# Altium project PR003.PrjPcb (part 10 of 11)
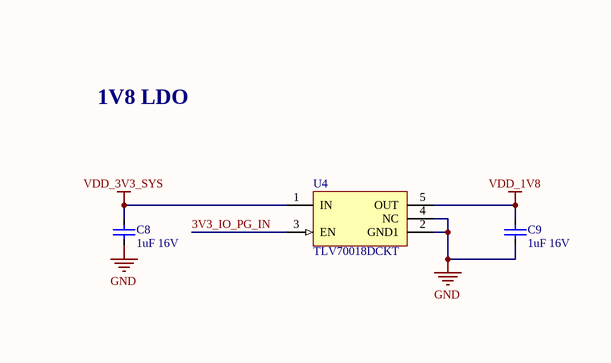
[diagram p117: Power_Circuit.SchDoc, right]

## Sheet Power_Circuit.SchDoc (continued)

### Library data of the parts (continued)
R23 = AC0603FR-0710KL: RES SMD 10K OHM 1% 1/10W 0603; Manufacturer: Yageo; Resistance: 10kR; Power Rating: 100mW; Voltage Rating: 50V; Temperature Coefficient: 100ppm/°C; Supplier 1: Digi-Key; Manufacturer Part Number: AC0603FR-0710KL; RoHS: Yes; Category: Chip SMD Resistors; Stock 1: 1821004; Pricing 1: 1=0.10000, 10=0.02500, 100=0.01030, 1000=0.00463, 2500=0.00402 (USD); Mount: Surface Mount; Case/Package: 0603; Case Code (Imperial): 0603; Case Code (Metric): 1608; Size Code: 0603; Min Operating Temperature: -55°C; Max Operating Temperature: 155°C; Tolerance: 1%; Packaging: Tape and Reel; Package Quantity: 1; Termination: SMD/SMT; Resistor Type: Thick Film; Number of Terminations: 2; Max Power Dissipation: 100mW; Features: Moisture Resistant,Automotive AEC-Q200,Anti-Sulfur; Series: AC; Construction: Rectangular; Length: 1.6mm; Width: 0.8mm; Height: 0.022inch; Depth: 0.8mm; Military Standard: Not; Lead Free: Lead Free; RoHS Compliant: Yes; ComponentLink1URL: https://datasheet.ciiva.com/26862/getdatasheetpartid-724997-26862461.pdf?src-supplier=Verical; ComponentLink1Description: https://datasheet.ciiva.com/26862/getdatasheetpartid-724997-26862461.pdf?src-supplier=Verical; Supplier Part Number 1: 311-10KLDCT-ND
R27 = RC0402FR-0740K2L: Res Thick Film 0402 40.2K Ohm 1% 0.063W(1/16W) ±100ppm/°C Pad SMD T/R; Manufacturer: Yageo; Resistance: 40.2kR; Power Rating: 62.5mW; Voltage Rating: 50V; Max Power Dissipation: 63mW; Supplier 1: Digi-Key; Manufacturer Part Number: RC0402FR-0740K2L; RoHS: Yes; Category: Chip SMD Resistors; Stock 1: 2852749; Pricing 1: 1=0.10000, 10=0.01400, 100=0.00580, 1000=0.00262, 2500=0.00228, 5000=0.00188 (USD); Case/Package: 0402; Case Code (Metric): 1005; Case Code (Imperial): 0402; Contact Plating: Tin,Matte; Size Code: 0402; Min Operating Temperature: -55°C; Max Operating Temperature: 155°C; Package Quantity: 1; Tolerance: 1%; Packaging: Tape and Reel; Resistor Type: Thick Film; Number of Terminations: 2; Termination: SMD/SMT; Temperature Coefficient: 100ppm/°C; Features: Moisture Resistant; Series: RC; Construction: Rectangular; Voltage Rating (DC): 50V; Length: 0.039inch; Width: 0.02inch; Height: 0.016inch; Depth: 0.5mm; Military Standard: Not; Lead Free: Lead Free; RoHS Compliant: Yes; ComponentLink1URL: https://datasheet.ciiva.com/2453/pyu-r-int-thick-7-2453437.pdf?src-supplier=Digi-Key; ComponentLink1Description: https://datasheet.ciiva.com/2453/pyu-r-int-thick-7-2453437.pdf?src-supplier=Digi-Key; ComponentLink2URL: https://datasheet.ciiva.com/2453/pyu-r-int-thick-7-2453438.pdf?src-supplier=Digi-Key; ComponentLink2Description: https://datasheet.ciiva.com/2453/pyu-r-int-thick-7-2453438.pdf?src-supplier=Digi-Key; ComponentLink3URL: https://datasheet.ciiva.com/2453/pyu-r-int-thick-7-2453436.pdf?src-supplier=Digi-Key; ComponentLink3Description: https://datasheet.ciiva.com/2453/pyu-r-int-thick-7-2453436.pdf?src-supplier=Digi-Key; ComponentLink4URL: https://datasheet.ciiva.com/5557/pyu-rc0402-51-rohs-l-6-r-5557981.pdf?src-supplier=Mouser; ComponentLink4Description: https://datasheet.ciiva.com/5557/pyu-rc0402-51-rohs-l-6-r-5557981.pdf?src-supplier=Mouser; ComponentLink5URL: https://datasheet.ciiva.com/8889/pyu-rc0402-51-rohs-l-6-8889263.pdf?src-supplier=Avnet; ComponentLink5Description: https://datasheet.ciiva.com/8889/pyu-rc0402-51-rohs-l-6-8889263.pdf?src-supplier=Avnet; ComponentLink6URL: https://datasheet.ciiva.com/16744/pyu-rc0402-51-rohs-l-6-r-16744286.pdf?src-supplier=Future+Electronics; ComponentLink6Description: https://datasheet.ciiva.com/16744/pyu-rc0402-51-rohs-l-6-r-16744286.pdf?src-supplier=Future+Electronics; Supplier Part Number 1: 311-40.2KLRCT-ND
R29 = RC0402FR-078K87L: Res Thick Film 0402 8.87K Ohm 1% 1/16W ±100ppm/°C Molded SMD Paper T/R; Manufacturer: Yageo; Resistance: 8.87kR; Voltage Rating (DC): 50V; Power Rating: 62.5mW; Max Power Dissipation: 63mW; Supplier 1: Digi-Key; Manufacturer Part Number: RC0402FR-078K87L; RoHS: Yes; Category: Chip SMD Resistors; Stock 1: 661203; Pricing 1: 1=0.10000, 10=0.01400, 100=0.00580, 1000=0.00262, 2500=0.00228, 5000=0.00188 (USD); Case/Package: 0402; Case Code (Imperial): 0402; Case Code (Metric): 1005; Contact Plating: Tin,Matte; Min Operating Temperature: -55°C; Max Operating Temperature: 155°C; Tolerance: 1%; Packaging: Tape and Reel; Features: Moisture Resistant; Voltage Rating: 50V; Termination: SMD/SMT; Resistor Type: Thick Film; Temperature Coefficient: 100ppm/°C; Number of Terminations: 2; Series: RC; Construction: Rectangular; Working Voltage: 50V; Technology: THICK FILM; Length: 1mm; Width: 0.5mm; Height: 0.35mm; Depth: 0.5mm; Lead Free: Lead Free; Military Standard: Not; RoHS Compliant: Yes; ComponentLink1URL: https://datasheet.ciiva.com/12575/pyu-rc0402-51-rohs-l-6-r-8721-12575212.pdf?src-supplier=Mouser; ComponentLink1Description: https://datasheet.ciiva.com/12575/pyu-rc0402-51-rohs-l-6-r-8721-12575212.pdf?src-supplier=Mouser; ComponentLink2URL: https://datasheet.ciiva.com/16743/pyu-rc0402-51-rohs-l-6-r-16743879.pdf?src-supplier=Future+Electronics; ComponentLink2Description: https://datasheet.ciiva.com/16743/pyu-rc0402-51-rohs-l-6-r-16743879.pdf?src-supplier=Future+Electronics; Supplier Part Number 1: 311-8.87KLRCT-ND
U1 U2 = TPS25944LRVCT: Hot Swap Controller 1-CH 18V N-Channel Positive Voltage 20-Pin WQFN EP T/R; Manufacturer: Texas Instruments; Min Supply Voltage: 2.7V; Number of Channels: 1; Supplier 1: Mouser; Manufacturer Part Number: TPS25944LRVCT; RoHS: Yes; Category: Power Management ICs; Stock 1: 1962; Pricing 1: 1=2.72000, 10=2.45000, 50=2.31000, 100=1.97000, 1000=1.34000, 10000=1.34000 (USD); Number of Pins: 20; Min Operating Temperature: -40°C; Max Operating Temperature: 85°C; Max Supply Voltage: 18V; Packaging: Cut Tape; Reach SVHC Compliant: Yes; Lead Free: Lead Free; RoHS Compliant: Yes; ComponentLink1URL: http://www.ti.com/general/docs/lit/getliterature.tsp?genericPartNumber=TPS25944L&&fileType=pdf&src-supplier=Farnell; ComponentLink1Description: http://www.ti.com/general/docs/lit/getliterature.tsp?genericPartNumber=TPS25944L&&fileType=pdf&src-supplier=Farnell; ComponentLink2URL: http://www.ti.com/general/docs/lit/getliterature.tsp?genericPartNumber=TPS25944L&&fileType=pdf&src-supplier=Element14; ComponentLink2Description: http://www.ti.com/general/docs/lit/getliterature.tsp?genericPartNumber=TPS25944L&&fileType=pdf&src-supplier=Element14; ComponentLink3URL: http://www.ti.com/general/docs/lit/getliterature.tsp?genericPartNumber=TPS25944L&amp;&amp;fileType=pdf&src-supplier=Farnell; ComponentLink3Description: http://www.ti.com/general/docs/lit/getliterature.tsp?genericPartNumber=TPS25944L&amp;&amp;fileType=pdf&src-supplier=Farnell; ComponentLink4URL: http://www.ti.com/lit/pdf/slvsce9?src-supplier=Digi-Key; ComponentLink4Description: http://www.ti.com/lit/pdf/slvsce9?src-supplier=Digi-Key; ComponentLink5URL: http://www.ti.com/general/docs/suppproductinfo.tsp?distId=10&amp;gotoUrl=http%3A%2F%2Fwww.ti.com%2Flit%2Fgpn%2FTPS25942A&src-supplier=Digi-Key; ComponentLink5Description: http://www.ti.com/general/docs/suppproductinfo.tsp?distId=10&amp;gotoUrl=http%3A%2F%2Fwww.ti.com%2Flit%2Fgpn%2FTPS25942A&src-supplier=Digi-Key; ComponentLink6URL: http://www.ti.com/general/docs/lit/getliterature.tsp?genericPartNumber=TPS25942L&&fileType=pdf&src-supplier=Avnet; ComponentLink6Description: http://www.ti.com/general/docs/lit/getliterature.tsp?genericPartNumber=TPS25942L&&fileType=pdf&src-supplier=Avnet; Supplier Part Number 1: 595-TPS25944LRVCT
U3 = SN74LVC1G07DCKRE4: Single 1.65-V to 5.5-V buffer with open-drain outputs 5-SC70 -40 to 125; Manufacturer: Texas Instruments; Logic Function: Buffer,Inverting; Number of Elements: 1; Max Supply Voltage: 5.5V; Min Supply Voltage: 1.65V; Propagation Delay: 4.2ns; Low Level Output Current: 32mA; Polarity: Non-Inverting; Turn-On Delay Time: 8.3ns; Quiescent Current: 10uA; Supplier 1: Digi-Key; Manufacturer Part Number: SN74LVC1G07DCKRE4; RoHS: Yes; Category: Buffers, Drivers and Transceivers; Stock 1: 1390; Pricing 1: 1=0.32000, 10=0.24000, 25=0.21000, 100=0.13590, 250=0.11248, 500=0.09000, 1000=0.06900 (USD); Mount: Surface Mount; Case/Package: SC; Number of Pins: 5; Min Operating Temperature: -40°C; Max Operating Temperature: 125°C; Packaging: Tape and Reel; Package Quantity: 1; Number of Channels: 1; Number of Inputs: 1; Number of Outputs: 1; Number of Bits per Element: 1; Number of Input Lines: 1; Number of Output Lines: 1; Number of Gates: 1; Number of Bits: 1; Series: 74LVC; Technology: CMOS; Radiation Hardening: No; Reach SVHC Compliant: Yes; Lead Free: Lead Free; RoHS Compliant: Yes; ComponentLink1URL: https://datasheet.ciiva.com/14319/sn74lvc1g07-14319317.pdf?src-supplier=Avnet; ComponentLink1Description: https://datasheet.ciiva.com/14319/sn74lvc1g07-14319317.pdf?src-supplier=Avnet; ComponentLink2URL: https://datasheet.ciiva.com/18621/sn74lvc1g07-18621567.pdf?src-supplier=Digi-Key; ComponentLink2Description: https://datasheet.ciiva.com/18621/sn74lvc1g07-18621567.pdf?src-supplier=Digi-Key; Supplier Part Number 1: 296-35936-1-ND
U4 = TLV70018DCKT: IC, LDO, 200MA, 1.8V, 5SC70; Input Voltage Min:2V; Input Voltage Max:5.5V; Output Voltage Nom.:1.8V; Output Current:200mA; Dropout Voltage Vdo:175mV; LDO Regulator Case Style:SC-70; No. of Pins:5; Operating Temperature Min:-40°C; ;RoHS Compliant: Yes; Manufacturer: Texas Instruments; Dropout Voltage: 175mV; Number of Outputs: 1; Max Power Dissipation: 320mW; Max Input Voltage: 5.5V; Min Input Voltage: 2V; Min Current Limit: 220mA; Polarity: Positive; Quiescent Current: 30uA; Accuracy: 2%; Max Supply Current: 270uA; Nominal Supply Current: 31uA; Output Type: Fixed; Power Supply Rejection Ratio (PSRR): 68dB; Supplier 1: Digi-Key; Manufacturer Part Number: TLV70018DCKT; RoHS: Yes; Category: Voltage Regulators - Linear; Stock 1: 6750; Pricing 1: 1=1.08000, 10=0.96600, 25=0.91720, 100=0.75330 (USD); Case/Package: SC; Number of Pins: 5; Contact Plating: Gold; Min Operating Temperature: -40°C; Max Operating Temperature: 125°C; Output Current: 200mA; Nominal Output Voltage: 1.8V; Packaging: Tape and Reel; Output Voltage: 1.8V; Package Quantity: 250; Max Output Current: 200mA; Number of Regulators: 1; Power Dissipation: 320mW; Min Output Voltage: 1.8V; Power Rating: 320mW; Output Voltage Accuracy: 2%; Max Output Voltage: 1.8V; Series: -; Supply Current: 31uA; Output Configuration: Positive; Length: 2.15mm; Width: 1.4mm; Height: 1mm; Radiation Hardening: No; Reach SVHC Compliant: Yes; Lead Free: Lead Free; RoHS Compliant: Yes; ComponentLink1URL: https://datasheet.ciiva.com/14149/tlv700-eng-ds-14149837.pdf?src-supplier=Distrelec; ComponentLink1Description: https://datasheet.ciiva.com/14149/tlv700-eng-ds-14149837.pdf?src-supplier=Distrelec; ComponentLink2URL: https://datasheet.ciiva.com/7992/1882059-7992894.pdf?src-supplier=Element14; ComponentLink2Description: https://datasheet.ciiva.com/7992/1882059-7992894.pdf?src-supplier=Element14; ComponentLink3URL: https://datasheet.ciiva.com/22700/1882059-22700171.pdf?src-supplier=Element14; ComponentLink3Description: https://datasheet.ciiva.com/22700/1882059-22700171.pdf?src-supplier=Element14; Supplier Part Number 1: 296-25269-1-ND
U5 = MP2384GG-Z: IC Reg Buck Adjustable 4A 11QFN; Manufacturer: Monolithic Power Systems; Output Configuration: Positive; Number of Outputs: 1; Min Input Voltage: 4.5V; Max Input Voltage: 24V; Min Output Voltage: 600mV; Max Output Voltage: 13V; Switching Frequency: 700kHz; Synchronous Rectifier: Yes; Supplier 1: Mouser; Manufacturer Part Number: MP2384GG-Z; RoHS: No; Category: Voltage Regulators - Switching; Stock 1: 14980; Pricing 1: 1=1.97000, 10=1.77000, 50=1.67000, 100=1.43000, 1000=0.96900, 10000=0.88100 (USD); Mount: Surface Mount; Case/Package: QFN; Number of Pins: 11; Min Operating Temperature: -40°C; Max Operating Temperature: 125°C; Output Type: Adjustable; Packaging: Tape and Reel; Output Current: 4A; ComponentLink1URL: https://media.digikey.com/pdf/Data%20Sheets/Monolithic%20Power%20PDFs/MP2384_r1.0.pdf?src-supplier=Digi-Key; ComponentLink1Description: https://media.digikey.com/pdf/Data%20Sheets/Monolithic%20Power%20PDFs/MP2384_r1.0.pdf?src-supplier=Digi-Key; Supplier Part Number 1: 946-MP2384GG-Z

## Sheet ON_OFF_Circuit.SchDoc
size A3; SheetNumber: 16; SheetTotal: 16
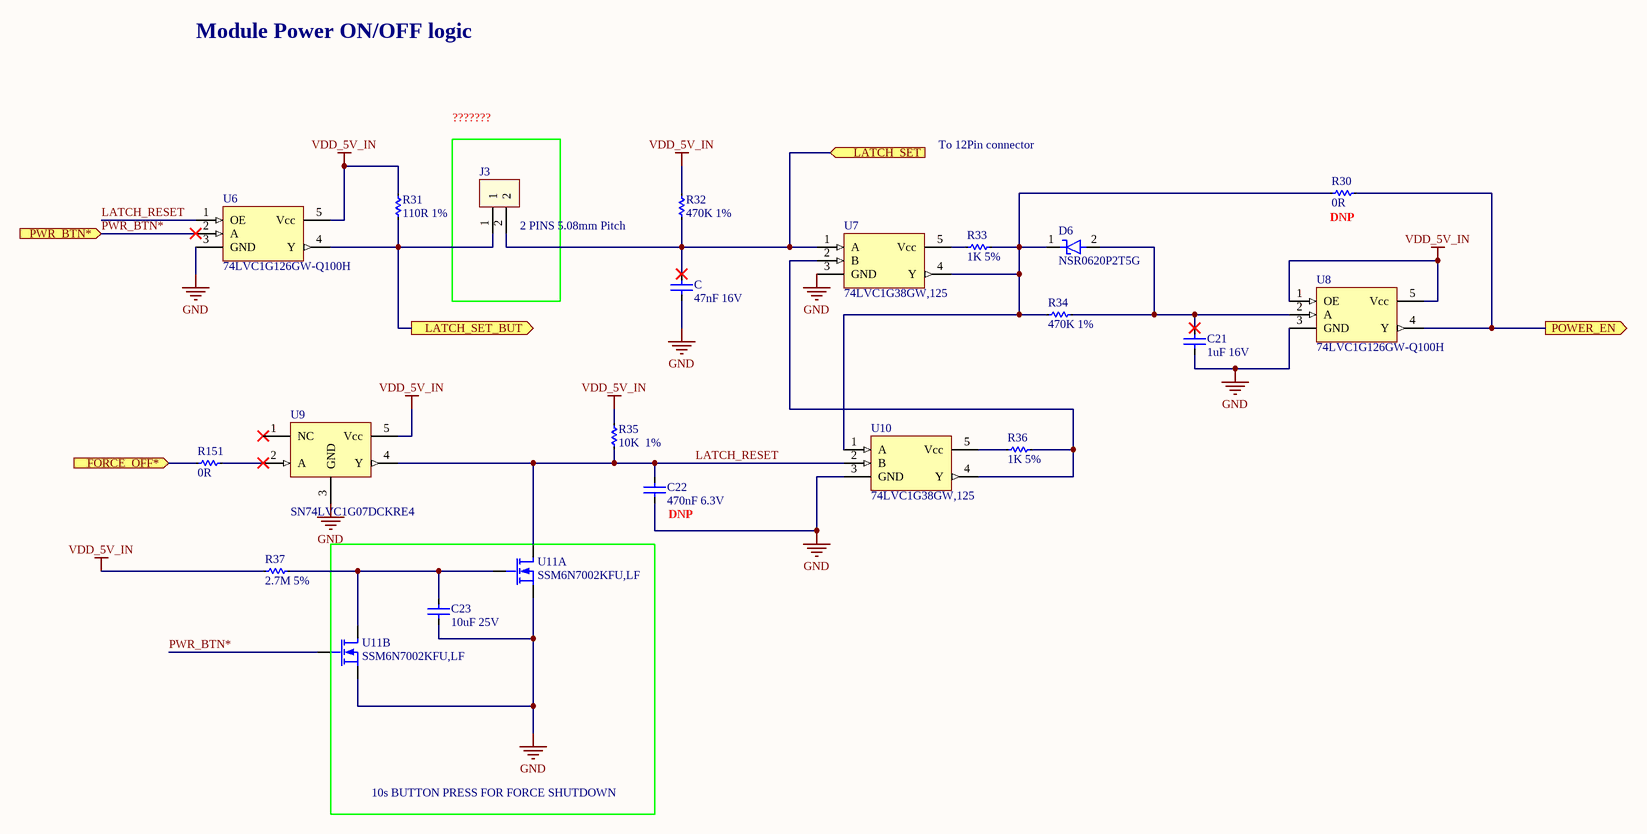
[diagram p15: ON_OFF_Circuit.SchDoc]

### Parts
C  47nF 16V  [C0603]
C21  1uF 16V  [C0603]
C22  470nF 6.3V  [C0402]
C23  10uF 25V  [C0805]
D6  NSR0620P2T5G  [SOD-923]
J3  2 PINS 5.08mm Pitch  [0395443002]
R30  0R  [R0603]
R31  110R 1%  [R0402]
R32  470K 1%  [R0402]
R33  1K 5%  [R0402]
R34  470K 1%  [R0402]
R35  10K  1%  [R0402]
R36  1K 5%  [R0402]
R37  2.7M 5%  [R0402]
R151  0R  [R0402]
U6  74LVC1G126GW-Q100H  [SOT-353-1(TSSOP5)]
U7  74LVC1G38GW,125  [SOT-353-1(TSSOP5)]
U8  74LVC1G126GW-Q100H  [SOT-353-1(TSSOP5)]
U9  SN74LVC1G07DCKRE4  [SC70-5]
U10  74LVC1G38GW,125  [SOT-353-1(TSSOP5)]
U11  SSM6N7002KFU,LF  [SOT-363]  (parts A,B of 2)

### Blocks framed on the sheet
???????: J3
10s BUTTON PRESS FOR FORCE SHUTDOWN: C23 U11

### Ports
FORCE_OFF* (in), LATCH_SET (in), LATCH_SET_BUT (out), POWER_EN (out), PWR_BTN* (in)

### Nets
GND: C.1 C21.1 C22.1 C23.1 U6.3(GND) U7.3(GND) U8.3(GND) U9.3(GND) U10.3(GND) U11.1(S1) U11.4(S2)
VDD_5V_IN: R31.2 R32.2 R35.1 R37.1 U6.5(Vcc) U8.1(OE) U8.5(Vcc) U9.5(Vcc)
FORCE_OFF*: R151.1 ; port FORCE_OFF*
LATCH_RESET: C22.2 R35.2 U6.1(OE) U9.4(Y) U10.2(B) U11.6(D1)
LATCH_SET: C.2 J3.2 R32.1 U7.1(A) ; port LATCH_SET
LATCH_SET_BUT: J3.1 R31.1 U6.4(Y) ; port LATCH_SET_BUT
POWER_EN: R30.2 U8.4(Y) ; port POWER_EN
PWR_BTN*: U6.2(A) U11.5(G2) ; port PWR_BTN*
NetC21_2: C21.2 D6.2(A) R34.2 U8.2(A)
NetC23_2: C23.2 R37.2 U11.2(G1) U11.3(D2)
NetD6_1: D6.1(K) R30.1 R33.2 R34.1 U7.4(Y) U10.1(A)
NetR33_1: R33.1 U7.5(Vcc)
NetR36_1: R36.1 U10.5(Vcc)
NetR36_2: R36.2 U7.2(B) U10.4(Y)
NetR151_2: R151.2 U9.2(A)

Not connected (* = marked no-connect by the designer): U9 1(NC)*

### Notes on the sheet
- Module Power ON/OFF logic
- To 12Pin connector
- (near R30) DNP
- (near C22) DNP

### Library data of the parts
C = C0603C473K4RACTU: Cap Ceramic 0.047uF 16V X7R 10% SMD 0603 125°C Paper T/R; Manufacturer: KEMET; Dissipation Factor: 3.5%; Supplier 1: Digi-Key; Manufacturer Part Number: C0603C473K4RACTU; RoHS: Yes; Category: Ceramic Capacitors; Stock 1: 97181; Pricing 1: 1=0.10000, 10=0.07200, 50=0.03940, 100=0.03220, 500=0.02298, 1000=0.01805 (USD); Mount: Surface Mount,PCB; Case/Package: 0603; Case Code (Imperial): 0603; Case Code (Metric): 1608; Dielectric Material: Ceramic; Contact Plating: Tin,Matte; Min Operating Temperature: -55°C; Max Operating Temperature: 125°C; Capacitance: 47nF; Tolerance: 10%; Voltage Rating (DC): 16V; Packaging: Tape and Reel; Package Quantity: 1; Voltage Rating: 16V; Dielectric: X7R; Termination: SMD/SMT; Voltage: 16V; Series: C; Construction: Flat; Length: 1.6mm; Width: 0.031inch; Height: 0.8mm; Lead Pitch: 0.7mm; Thickness: 0.034inch; Depth: 0.8mm; Radiation Hardening: No; Reach SVHC Compliant: Yes; RoHS Compliant: Yes; ComponentLink1URL: https://datasheet.ciiva.com/5424/kem-c1002-x7r-smd-357932-5424341.pdf?src-supplier=Mouser; ComponentLink1Description: https://datasheet.ciiva.com/5424/kem-c1002-x7r-smd-357932-5424341.pdf?src-supplier=Mouser; ComponentLink2URL: https://datasheet.ciiva.com/18193/getdatasheetpartid-115745-18193110.pdf?src-supplier=Verical; ComponentLink2Description: https://datasheet.ciiva.com/18193/getdatasheetpartid-115745-18193110.pdf?src-supplier=Verical; ComponentLink3URL: https://datasheet.ciiva.com/28682/1851736-28682295.pdf?src-supplier=Element14; ComponentLink3Description: https://datasheet.ciiva.com/28682/1851736-28682295.pdf?src-supplier=Element14; ComponentLink4URL: https://datasheet.ciiva.com/46385/1851736-46385609.pdf?src-supplier=Element14; ComponentLink4Description: https://datasheet.ciiva.com/46385/1851736-46385609.pdf?src-supplier=Element14; ComponentLink5URL: https://datasheet.ciiva.com/49516/1565935-49516538.pdf?src-supplier=Jameco; ComponentLink5Description: https://datasheet.ciiva.com/49516/1565935-49516538.pdf?src-supplier=Jameco; ComponentLink6URL: https://datasheet.ciiva.com/46445/1851736-46445228.pdf?src-supplier=Element14; ComponentLink6Description: https://datasheet.ciiva.com/46445/1851736-46445228.pdf?src-supplier=Element14; Supplier Part Number 1: 399-C0603C473K4RAC7867CT-ND
C21 = 0603YD105KAT2A: as C1 on sheet Power_Circuit; Supplier 1: Digi-Key; Manufacturer Part Number: 0603YD105KAT2A; RoHS: Yes; Category: Ceramic Capacitors; Stock 1: 1533757; Pricing 1: 1=0.12000, 10=0.08200, 50=0.04660, 100=0.03870, 500=0.02710, 1000=0.02244 (USD); Mount: Surface Mount; Case/Package: 0603; Number of Pins: 2; Case Code (Metric): 1608; Case Code (Imperial): 0603; Min Operating Temperature: -55°C; Max Operating Temperature: 85°C; Capacitance: 1uF; Voltage Rating (DC): 16V; Packaging: Tape and Reel; Dielectric: X5R; Voltage: 16V; Voltage Rating: 16V; Package Quantity: 1; Termination: SMD/SMT; Series: -; Construction: Flat; Length: 1.6mm; Width: 0.032inch; Height: 0.9mm; Depth: 0.81mm; Thickness: 0.035inch; Radiation Hardening: No; Reach SVHC Compliant: Yes; Lead Free: Lead Free; RoHS Compliant: Yes; ComponentLink1URL: https://datasheet.ciiva.com/11788/0900766b80def1a5-11788563.pdf?src-supplier=RSComponents; ComponentLink1Description: https://datasheet.ciiva.com/11788/0900766b80def1a5-11788563.pdf?src-supplier=RSComponents; ComponentLink2URL: https://datasheet.ciiva.com/34303/2012654-34303835.pdf?src-supplier=Jameco; ComponentLink2Description: https://datasheet.ciiva.com/34303/2012654-34303835.pdf?src-supplier=Jameco; ComponentLink3URL: https://datasheet.ciiva.com/2987/cx5r-2987890.pdf?src-supplier=Avnet; ComponentLink3Description: https://datasheet.ciiva.com/2987/cx5r-2987890.pdf?src-supplier=Avnet; ComponentLink4URL: https://datasheet.ciiva.com/5412/cx5r-5412550.pdf?src-supplier=Mouser; ComponentLink4Description: https://datasheet.ciiva.com/5412/cx5r-5412550.pdf?src-supplier=Mouser; ComponentLink5URL: https://datasheet.ciiva.com/150/cx5r-150392.pdf?src-supplier=Digi-Key; ComponentLink5Description: https://datasheet.ciiva.com/150/cx5r-150392.pdf?src-supplier=Digi-Key; ComponentLink6URL: https://datasheet.ciiva.com/14590/70001028-14590632.pdf?src-supplier=Allied+Electronics; ComponentLink6Description: https://datasheet.ciiva.com/14590/70001028-14590632.pdf?src-supplier=Allied+Electronics; ComponentLink7URL: https://datasheet.ciiva.com/150/cx5r-150393.pdf?src-supplier=Digi-Key; ComponentLink7Description: https://datasheet.ciiva.com/150/cx5r-150393.pdf?src-supplier=Digi-Key; ComponentLink8URL: https://datasheet.ciiva.com/1458/84508-1458137.pdf?src-supplier=Element14; ComponentLink8Description: https://datasheet.ciiva.com/1458/84508-1458137.pdf?src-supplier=Element14; ComponentLink9URL: https://datasheet.ciiva.com/150/cx5r-150394.pdf?src-supplier=Digi-Key; ComponentLink9Description: https://datasheet.ciiva.com/150/cx5r-150394.pdf?src-supplier=Digi-Key; ComponentLink10URL: https://datasheet.ciiva.com/1458/84508-1458138.pdf?src-supplier=Element14; ComponentLink10Description: https://datasheet.ciiva.com/1458/84508-1458138.pdf?src-supplier=Element14; ComponentLink11URL: https://datasheet.ciiva.com/14586/70001028-14586715.pdf?src-supplier=Allied+Electronics; ComponentLink11Description: https://datasheet.ciiva.com/14586/70001028-14586715.pdf?src-supplier=Allied+Electronics; Supplier Part Number 1: 478-1249-1-ND
C22 = GRM155R60J474KE19D: CAP CER 0.47UF 6.3V X5R 0402; Manufacturer: Murata; Dielectric Material: Ceramic; Tolerance: 10%; Insulation Resistance: 10GR; Supplier 1: Digi-Key; Manufacturer Part Number: GRM155R60J474KE19D; RoHS: Yes; Category: Ceramic Capacitors; Stock 1: 5374052; Pricing 1: 1=0.10000, 10=0.05200, 50=0.02840, 100=0.02330, 500=0.01662, 1000=0.01305, 2500=0.01187, 5000=0.01092 (USD); Mount: Surface Mount; Case/Package: 0402; Number of Pins: 2; Case Code (Metric): 1005; Case Code (Imperial): 0402; Min Operating Temperature: -55°C; Max Operating Temperature: 85°C; Capacitance: 470nF; Voltage Rating: 6.3V; Voltage Rating (DC): 6.3V; Packaging: Tape and Reel; Package Quantity: 1; Dielectric: X5R; Termination: SMD/SMT; Voltage: 6.3V; Series: GRM; Construction: Flat; Length: 1mm; Width: 0.5mm; Height: 0.5mm; Thickness: 0.022inch; Depth: 0.5mm; Radiation Hardening: No; Reach SVHC Compliant: Yes; Lead Free: Lead Free; RoHS Compliant: Yes; ComponentLink1URL: https://datasheet.ciiva.com/7718/1718360-7718998.pdf?src-supplier=Element14; ComponentLink1Description: https://datasheet.ciiva.com/7718/1718360-7718998.pdf?src-supplier=Element14; ComponentLink2URL: https://datasheet.ciiva.com/132/grm155r60j474ke19-01-132620.pdf?src-supplier=Digi-Key; ComponentLink2Description: https://datasheet.ciiva.com/132/grm155r60j474ke19-01-132620.pdf?src-supplier=Digi-Key; ComponentLink3URL: https://datasheet.ciiva.com/132/grm155r60j474ke19-01-132619.pdf?src-supplier=Digi-Key; ComponentLink3Description: https://datasheet.ciiva.com/132/grm155r60j474ke19-01-132619.pdf?src-supplier=Digi-Key; ComponentLink4URL: https://datasheet.ciiva.com/132/grm155r60j474ke19-01-132621.pdf?src-supplier=Digi-Key; ComponentLink4Description: https://datasheet.ciiva.com/132/grm155r60j474ke19-01-132621.pdf?src-supplier=Digi-Key; ComponentLink5URL: https://datasheet.ciiva.com/16339/grm155r60j474ke19d-16339488.pdf?src-supplier=Future+Electronics; ComponentLink5Description: https://datasheet.ciiva.com/16339/grm155r60j474ke19d-16339488.pdf?src-supplier=Future+Electronics; ComponentLink6URL: https://datasheet.ciiva.com/18184/getdatasheetpartid-153134-18184579.pdf?src-supplier=Verical; ComponentLink6Description: https://datasheet.ciiva.com/18184/getdatasheetpartid-153134-18184579.pdf?src-supplier=Verical; ComponentLink7URL: https://datasheet.ciiva.com/7718/c02e-7718997.pdf?src-supplier=Element14; ComponentLink7Description: https://datasheet.ciiva.com/7718/c02e-7718997.pdf?src-supplier=Element14; ComponentLink8URL: https://datasheet.ciiva.com/2989/product-2989363.pdf?src-supplier=Avnet; ComponentLink8Description: https://datasheet.ciiva.com/2989/product-2989363.pdf?src-supplier=Avnet; ComponentLink9URL: https://datasheet.ciiva.com/2989/product-2989362.pdf?src-supplier=Avnet; ComponentLink9Description: https://datasheet.ciiva.com/2989/product-2989362.pdf?src-supplier=Avnet; Supplier Part Number 1: 490-3266-1-ND
C23 = TMK212BBJ106KG-T: as C36 on sheet HDMI_Connector; Supplier 1: Digi-Key; Manufacturer Part Number: TMK212BBJ106KG-T; RoHS: Yes; Category: Ceramic Capacitors; Stock 1: 3515248; Pricing 1: 1=0.18000, 10=0.12400, 50=0.07460, 100=0.06290, 500=0.04306, 1000=0.03810 (USD); Mount: Surface Mount; Case/Package: 0805; Number of Pins: 2; Case Code (Metric): 2012; Case Code (Imperial): 0805; Min Operating Temperature: -55°C; Max Operating Temperature: 85°C; Capacitance: 10uF; Tolerance: 10%; Packaging: Tape and Reel; Voltage Rating (DC): 25V; Package Quantity: 1; Voltage Rating: 25V; Termination: SMD/SMT; Resistor Type: Ceramic; Series: M; Length: 0.079inch; Width: 0.049inch; Height: 1.25mm; Thickness: 0.053inch; Lead Free: Lead Free; Reach SVHC Compliant: Yes; RoHS Compliant: Yes; ComponentLink1URL: https://datasheet.ciiva.com/30062/tmk212bbj106kg-t-30062083.pdf?src-supplier=Onlinecomponents.com; ComponentLink1Description: https://datasheet.ciiva.com/30062/tmk212bbj106kg-t-30062083.pdf?src-supplier=Onlinecomponents.com; ComponentLink2URL: https://datasheet.ciiva.com/7975/1481447-7975820.pdf?src-supplier=Element14; ComponentLink2Description: https://datasheet.ciiva.com/7975/1481447-7975820.pdf?src-supplier=Element14; ComponentLink3URL: https://datasheet.ciiva.com/139/mlcc-all-e-139571.pdf?src-supplier=Digi-Key; ComponentLink3Description: https://datasheet.ciiva.com/139/mlcc-all-e-139571.pdf?src-supplier=Digi-Key; ComponentLink4URL: https://datasheet.ciiva.com/139/mlcc-all-e-139570.pdf?src-supplier=Digi-Key; ComponentLink4Description: https://datasheet.ciiva.com/139/mlcc-all-e-139570.pdf?src-supplier=Digi-Key; ComponentLink5URL: https://datasheet.ciiva.com/139/mlcc-all-e-139572.pdf?src-supplier=Digi-Key; ComponentLink5Description: https://datasheet.ciiva.com/139/mlcc-all-e-139572.pdf?src-supplier=Digi-Key; Supplier Part Number 1: 587-2985-1-ND
D6 = NSR0620P2T5G: NSR06 Series 20 V 2 uA Surface Mount Schottky Barrier Diode - SOD-923; Manufacturer: ON Semiconductor; Forward Current: 500mA; Max Surge Current: 1A; Forward Voltage: 520mV; Recovery Time: 4ns; Max Reverse Leakage Current: 10uA; Max Repetitive Reverse Voltage (Vrrm): 20V; Element Configuration: Single; Supplier 1: Mouser; Manufacturer Part Number: NSR0620P2T5G; RoHS: Yes; Category: Schottky Diodes; Stock 1: 88777; Pricing 1: 1=0.40000, 10=0.29900, 50=0.29900, 100=0.18700, 1000=0.09900, 10000=0.07600 (USD); Case/Package: SOD-923-2; Number of Pins: 2; Contact Plating: Tin,Matte; Min Operating Temperature: -55°C; Max Operating Temperature: 125°C; Package Quantity: 1; Packaging: Tape and Reel; Average Rectified Current: 500mA; Reverse Recovery Time: 4ns; Peak Non-Repetitive Surge Current: 1A; Max Forward Surge Current (Ifsm): 1A; Max Reverse Voltage (DC): 20V; Series: -; Radiation Hardening: No; Reach SVHC Compliant: Yes; Lead Free: Lead Free; RoHS Compliant: Yes; ComponentLink1URL: https://datasheet.ciiva.com/22663/nsr0620p2-d-22663697.pdf?src-supplier=Element14; ComponentLink1Description: https://datasheet.ciiva.com/22663/nsr0620p2-d-22663697.pdf?src-supplier=Element14; ComponentLink2URL: https://datasheet.ciiva.com/8293/nsr0620p2-d-8293901.pdf?src-supplier=Avnet; ComponentLink2Description: https://datasheet.ciiva.com/8293/nsr0620p2-d-8293901.pdf?src-supplier=Avnet; ComponentLink3URL: https://datasheet.ciiva.com/4714/nsr0620p2-d-113664-4714014.pdf?src-supplier=Mouser; ComponentLink3Description: https://datasheet.ciiva.com/4714/nsr0620p2-d-113664-4714014.pdf?src-supplier=Mouser; ComponentLink4URL: https://datasheet.ciiva.com/6381/nsr0620p2-d-6381877.pdf?src-supplier=Digi-Key; ComponentLink4Description: https://datasheet.ciiva.com/6381/nsr0620p2-d-6381877.pdf?src-supplier=Digi-Key; ComponentLink5URL: https://datasheet.ciiva.com/6381/nsr0620p2-d-6381880.pdf?src-supplier=Digi-Key; ComponentLink5Description: https://datasheet.ciiva.com/6381/nsr0620p2-d-6381880.pdf?src-supplier=Digi-Key; ComponentLink6URL: https://datasheet.ciiva.com/6381/nsr0620p2-d-6381882.pdf?src-supplier=Digi-Key; ComponentLink6Description: https://datasheet.ciiva.com/6381/nsr0620p2-d-6381882.pdf?src-supplier=Digi-Key; ComponentLink7URL: https://datasheet.ciiva.com/28646/nsr0620p2-d-28646587.pdf?src-supplier=Element14; ComponentLink7Description: https://datasheet.ciiva.com/28646/nsr0620p2-d-28646587.pdf?src-supplier=Element14; Supplier Part Number 1: 863-NSR0620P2T5G
J3 = 39544-3002: as J2 on sheet Power_Circuit; Supplier 1: Mouser; Manufacturer Part Number: 39544-3002; RoHS: Yes; Category: Terminal Blocks; Stock 1: 5531; Pricing 1: 1=1.06000, 10=0.71200, 50=0.71200, 100=0.69100, 1000=0.53300, 10000=0.47100 (USD); Mount: Through Hole; Contact Material: Brass; Contact Plating: Tin; Weight: 0.099473oz; Housing Color: Black; Housing Material: Polyamide; Min Operating Temperature: -40°C; Max Operating Temperature: 105°C; Package Quantity: 1440; Number of Rows: 1; Max Supply Voltage: 300V; Packaging: Bulk; Number of Contacts: 2; Number of Circuits: 2; Termination: Solder; Orientation: Vertical; Series: 39544; Length: 10.16mm; Height: 14.4mm; Wire/Cable Gauge: 22AWG; Pitch: 5.08mm; Depth: 10mm; Halogen Free: Low Halogen; Lead Free: Lead Free; Flammability Rating: UL94 V-0; ComponentLink1URL: https://datasheet.ciiva.com/5186/0395443002-terminal-blocks-167587-5186614.pdf?src-supplier=Mouser; ComponentLink1Description: https://datasheet.ciiva.com/5186/0395443002-terminal-blocks-167587-5186614.pdf?src-supplier=Mouser; Supplier Part Number 1: 538-39544-3002
R30 = CR0603-J/-000ELF: as R172 on sheet Block_UART, I2C, CAN and GPIOs; Supplier 1: Digi-Key; Manufacturer Part Number: CR0603-J/-000ELF; RoHS: Yes; Category: Chip SMD Resistors; Stock 1: 1690954; Pricing 1: 1=0.10000, 10=0.01300, 25=0.00960, 50=0.00720, 100=0.00540, 250=0.00408, 500=0.00328, 1000=0.00241 (USD); Mount: Surface Mount; Case/Package: 0603; Number of Pins: 2; Case Code (Imperial): 0603; Case Code (Metric): 1608; Contact Plating: Tin; Min Operating Temperature: -55°C; Max Operating Temperature: 155°C; Packaging: Tape and Reel; Package Quantity: 5000; Resistor Type: Thick Film; Termination: SMD/SMT; Max Power Dissipation: 100mW; Voltage Rating (DC): 50V; Series: CR0603; Technology: THICK FILM; Construction: Rectangular; Features: Moisture Resistant; Number of Terminations: 2; Length: 1.6mm; Width: 0.8mm; Height: 0.45mm; Depth: 0.8mm; Thickness: 457um; Radiation Hardening: No; Reach SVHC Compliant: Yes; Military Standard: Not; RoHS Compliant: Yes; ComponentLink1URL: https://datasheet.ciiva.com/11809/0900766b80fcdb72-11809586.pdf?src-supplier=RSComponents; ComponentLink1Description: https://datasheet.ciiva.com/11809/0900766b80fcdb72-11809586.pdf?src-supplier=RSComponents; ComponentLink2URL: https://datasheet.ciiva.com/7001/1902866-7001645.pdf?src-supplier=Newark; ComponentLink2Description: https://datasheet.ciiva.com/7001/1902866-7001645.pdf?src-supplier=Newark; ComponentLink3URL: https://datasheet.ciiva.com/7986/691949-7986171.pdf?src-supplier=Element14; ComponentLink3Description: https://datasheet.ciiva.com/7986/691949-7986171.pdf?src-supplier=Element14; ComponentLink4URL: https://datasheet.ciiva.com/7660/1856384-7660956.pdf?src-supplier=Element14; ComponentLink4Description: https://datasheet.ciiva.com/7660/1856384-7660956.pdf?src-supplier=Element14; ComponentLink5URL: https://datasheet.ciiva.com/22693/1902866-22693213.pdf?src-supplier=Element14; ComponentLink5Description: https://datasheet.ciiva.com/22693/1902866-22693213.pdf?src-supplier=Element14; ComponentLink6URL: https://datasheet.ciiva.com/5545/chpreztr-5545708.pdf?src-supplier=Mouser; ComponentLink6Description: https://datasheet.ciiva.com/5545/chpreztr-5545708.pdf?src-supplier=Mouser; ComponentLink7URL: https://datasheet.ciiva.com/16761/70154685-16761515.pdf?src-supplier=Allied+Electronics; ComponentLink7Description: https://datasheet.ciiva.com/16761/70154685-16761515.pdf?src-supplier=Allied+Electronics; ComponentLink8URL: https://datasheet.ciiva.com/30062/159chpreztr-30062601.pdf?src-supplier=Onlinecomponents.com; ComponentLink8Description: https://datasheet.ciiva.com/30062/159chpreztr-30062601.pdf?src-supplier=Onlinecomponents.com; ComponentLink9URL: https://datasheet.ciiva.com/48692/001055497-da-01-en-smd-wid-cr0603-j-000elf-0-0-ohm-1-10w-48692135.pdf?src-supplier=Conrad; ComponentLink9Description: https://datasheet.ciiva.com/48692/001055497-da-01-en-smd-wid-cr0603-j-000elf-0-0-ohm-1-10w-48692135.pdf?src-supplier=Conrad; Supplier Part Number 1: CR0603-J/-000ELFCT-ND
R31 = RT0402FRE07110RL: High Precision-High Stability Chip Resistor Thin Film 0402 110Ohm 1% Paper T/R; Manufacturer: Yageo; Power Rating: 62.5mW; Voltage Rating (DC): 50V; Temperature Coefficient: 50ppm/°C; Supplier 1: Digi-Key; Manufacturer Part Number: RT0402FRE07110RL; RoHS: Yes; Category: Chip SMD Resistors; Stock 1: 11129; Pricing 1: 1=0.10000, 10=0.07300, 100=0.02970, 500=0.01814, 1000=0.01336, 2500=0.01159, 5000=0.00958 (USD); Case/Package: 0402; Case Code (Imperial): 0402; Case Code (Metric): 1005; Weight: 2.3E-05oz; Min Operating Temperature: -55°C; Max Operating Temperature: 155°C; Resistance: 110R; Packaging: Cut Tape; Tolerance: 1%; Voltage Rating: 50V; Series: RT; Technology: THIN FILM; Termination: SMD/SMT; Package Quantity: 10000; Length: 1mm; Width: 0.5mm; Height: 0.3mm; Lead Free: Lead Free; RoHS Compliant: Yes; ComponentLink1URL: http://www.yageo.com/documents/recent/PYu-RT_1-to-0.01_RoHS_L_9.pdf?src-supplier=Digi-Key; ComponentLink1Description: http://www.yageo.com/documents/recent/PYu-RT_1-to-0.01_RoHS_L_9.pdf?src-supplier=Digi-Key; Supplier Part Number 1: 13-RT0402FRE07110RLCT-ND
R32 R34 = RC0402FR-07470KL: Res Thick Film 0402 470K Ohm 1% 1/16W +/-100ppm/ßC Molded SMD Paper T/R; Manufacturer: Yageo; Resistance: 470kR; Power Rating: 62.5mW; Voltage Rating: 50V; Temperature Coefficient: 100ppm/°C; Max Power Dissipation: 63mW; Supplier 1: Digi-Key; Manufacturer Part Number: RC0402FR-07470KL; RoHS: Yes; Category: Chip SMD Resistors; Stock 1: 1811642; Pricing 1: 1=0.10000, 10=0.01400, 100=0.00580, 1000=0.00262, 2500=0.00228, 5000=0.00188 (USD); Case/Package: 0402; Number of Pins: 2; Case Code (Imperial): 0402; Case Code (Metric): 1005; Size Code: 0402; Min Operating Temperature: -55°C; Max Operating Temperature: 155°C; Tolerance: 1%; Packaging: Tape and Reel; Package Quantity: 1; Features: Moisture Resistant; Voltage Rating (DC): 50V; Termination: SMD/SMT; Resistor Type: Thick Film; Number of Terminations: 2; Series: RC; Resistance Tolerance: 1%; Construction: Rectangular; Technology: THICK FILM; Length: 0.039inch; Width: 0.02inch; Height: 0.016inch; Depth: 0.5mm; Lead Free: Lead Free; Military Standard: Not; RoHS Compliant: Yes; Reach SVHC Compliant: Yes; ComponentLink1URL: https://datasheet.ciiva.com/46412/1018594-46412837.pdf?src-supplier=Element14; ComponentLink1Description: https://datasheet.ciiva.com/46412/1018594-46412837.pdf?src-supplier=Element14; ComponentLink2URL: https://datasheet.ciiva.com/2453/pyu-r-int-thick-7-2453434.pdf?src-supplier=Digi-Key; ComponentLink2Description: https://datasheet.ciiva.com/2453/pyu-r-int-thick-7-2453434.pdf?src-supplier=Digi-Key; ComponentLink3URL: https://datasheet.ciiva.com/2453/pyu-r-int-thick-7-2453435.pdf?src-supplier=Digi-Key; ComponentLink3Description: https://datasheet.ciiva.com/2453/pyu-r-int-thick-7-2453435.pdf?src-supplier=Digi-Key; ComponentLink4URL: https://datasheet.ciiva.com/2453/pyu-r-int-thick-7-2453433.pdf?src-supplier=Digi-Key; ComponentLink4Description: https://datasheet.ciiva.com/2453/pyu-r-int-thick-7-2453433.pdf?src-supplier=Digi-Key; ComponentLink5URL: https://datasheet.ciiva.com/7850/1018594-7850012.pdf?src-supplier=Element14; ComponentLink5Description: https://datasheet.ciiva.com/7850/1018594-7850012.pdf?src-supplier=Element14; ComponentLink6URL: https://datasheet.ciiva.com/7850/1018594-7850013.pdf?src-supplier=Element14; ComponentLink6Description: https://datasheet.ciiva.com/7850/1018594-7850013.pdf?src-supplier=Element14; ComponentLink7URL: https://datasheet.ciiva.com/15189/getdatasheetpartid-325138-15189462.pdf?src-supplier=Verical; ComponentLink7Description: https://datasheet.ciiva.com/15189/getdatasheetpartid-325138-15189462.pdf?src-supplier=Verical; Supplier Part Number 1: 311-470KLRCT-ND
R33 R36 = RC0402JR-071KL: Res General Purpose Thick Film 0402 1K Ohm 5% 1/16W ±100ppm/°C Molded SMD Paper T/R; Manufacturer: Yageo; Resistance: 1kR; Power Rating: 62.5mW; Voltage Rating: 50V; Max Power Dissipation: 63mW; Supplier 1: Digi-Key; Manufacturer Part Number: RC0402JR-071KL; RoHS: Yes; Category: Chip SMD Resistors; Stock 1: 19692124; Pricing 1: 1=0.10000, 10=0.01200, 100=0.00480, 1000=0.00214, 2500=0.00186, 5000=0.00154 (USD); Case/Package: 0402; Case Code (Imperial): 0402; Case Code (Metric): 1005; Size Code: 0402; Min Operating Temperature: -55°C; Max Operating Temperature: 155°C; Tolerance: 5%; Packaging: Cut Tape; Package Quantity: 1; Termination: SMD/SMT; Resistor Type: Thick Film; Number of Terminations: 2; Temperature Coefficient: 100ppm/°C; Features: Moisture Resistant; Series: RC; Resistance Tolerance: 5%; Construction: Rectangular; Length: 0.039inch; Width: 0.02inch; Height: 0.016inch; Depth: 0.5mm; Military Standard: Not; Lead Free: Lead Free; RoHS Compliant: Yes; Reach SVHC Compliant: Yes; ComponentLink1URL: https://datasheet.ciiva.com/7983/1018594-7983558.pdf?src-supplier=Element14; ComponentLink1Description: https://datasheet.ciiva.com/7983/1018594-7983558.pdf?src-supplier=Element14; ComponentLink2URL: https://datasheet.ciiva.com/2452/pyu-r-int-thick-7-2452756.pdf?src-supplier=Digi-Key; ComponentLink2Description: https://datasheet.ciiva.com/2452/pyu-r-int-thick-7-2452756.pdf?src-supplier=Digi-Key; ComponentLink3URL: https://datasheet.ciiva.com/2452/pyu-r-int-thick-7-2452757.pdf?src-supplier=Digi-Key; ComponentLink3Description: https://datasheet.ciiva.com/2452/pyu-r-int-thick-7-2452757.pdf?src-supplier=Digi-Key; ComponentLink4URL: https://datasheet.ciiva.com/2452/pyu-r-int-thick-7-2452755.pdf?src-supplier=Digi-Key; ComponentLink4Description: https://datasheet.ciiva.com/2452/pyu-r-int-thick-7-2452755.pdf?src-supplier=Digi-Key; ComponentLink5URL: https://datasheet.ciiva.com/7850/1018594-7850170.pdf?src-supplier=Element14; ComponentLink5Description: https://datasheet.ciiva.com/7850/1018594-7850170.pdf?src-supplier=Element14; ComponentLink6URL: https://datasheet.ciiva.com/7850/1018594-7850171.pdf?src-supplier=Element14; ComponentLink6Description: https://datasheet.ciiva.com/7850/1018594-7850171.pdf?src-supplier=Element14; ComponentLink7URL: https://datasheet.ciiva.com/17081/pyu-rc0402-51-rohs-l-6-r-17081438.pdf?src-supplier=Future+Electronics; ComponentLink7Description: https://datasheet.ciiva.com/17081/pyu-rc0402-51-rohs-l-6-r-17081438.pdf?src-supplier=Future+Electronics; Supplier Part Number 1: 311-1.0KJRCT-ND
R35 = RC0402FR-0710KP: as R80 on sheet HDMI_Connector; Supplier 1: Digi-Key; Manufacturer Part Number: RC0402FR-0710KP; RoHS: Yes; Category: Chip SMD Resistors; Stock 1: 1032587; Pricing 1: 1=0.10000, 10=0.03100, 100=0.01280, 1000=0.00573, 2500=0.00497, 5000=0.00411 (USD); Case/Package: 0402; Case Code (Metric): 1005; Case Code (Imperial): 0402; Min Operating Temperature: -55°C; Max Operating Temperature: 155°C; Packaging: Tape and Reel; Resistor Type: Thick Film; Number of Terminations: 2; Tolerance: 1%; Features: Moisture Resistant; Length: 0.039inch; Width: 0.02inch; Height: 0.016inch; RoHS Compliant: Yes; ComponentLink1URL: http://www.yageo.com/NewPortal/yageodocoutput?fileName=/pdf/R-Chip/PYu-RC_51_RoHS_P_0.pdf&src-supplier=Digi-Key; ComponentLink1Description: http://www.yageo.com/NewPortal/yageodocoutput?fileName=/pdf/R-Chip/PYu-RC_51_RoHS_P_0.pdf&src-supplier=Digi-Key; Supplier Part Number 1: YAG1249CT-ND
R37 = RC0402JR-072M7L: Res Thick Film 0402 2.7M Ohm 5% 1/16W ±100ppm/°C Molded SMD SMD Paper T/R; Manufacturer: Yageo; Power Rating: 62.5mW; Resistance: 2.7MR; Voltage Rating: 50V; Max Power Dissipation: 63mW; Supplier 1: Digi-Key; Manufacturer Part Number: RC0402JR-072M7L; RoHS: Yes; Category: Chip SMD Resistors; Stock 1: 54104; Pricing 1: 1=0.10000, 10=0.01200, 100=0.00480, 1000=0.00214, 2500=0.00186, 5000=0.00154 (USD); Case/Package: 0402; Case Code (Imperial): 0402; Case Code (Metric): 1005; Contact Plating: Tin,Matte; Min Operating Temperature: -55°C; Max Operating Temperature: 155°C; Packaging: Tape and Reel; Tolerance: 5%; Resistor Type: Thick Film; Number of Terminations: 2; Termination: SMD/SMT; Temperature Coefficient: 100ppm/°C; Features: Moisture Resistant; Series: RC; Length: 0.039inch; Width: 0.02inch; Height: 0.016inch; Radiation Hardening: No; Lead Free: Lead Free; RoHS Compliant: Yes; ComponentLink1URL: https://datasheet.ciiva.com/8894/pyu-rc0402-51-rohs-l-6-8894124.pdf?src-supplier=Avnet; ComponentLink1Description: https://datasheet.ciiva.com/8894/pyu-rc0402-51-rohs-l-6-8894124.pdf?src-supplier=Avnet; Supplier Part Number 1: YAG3294CT-ND
R151 = RC0402JR-070RP: Res Jumper Thick Film 0402 0 Ohm 5% 1/16W Molded SMD Paper T/R; Manufacturer: Yageo; Resistance: 0mR; Max Power Dissipation: 63mW; Supplier 1: Digi-Key; Manufacturer Part Number: RC0402JR-070RP; RoHS: Yes; Category: Chip SMD Resistors; Stock 1: 5886851; Pricing 1: 1=0.10000, 10=0.02300, 25=0.01640, 50=0.01240, 100=0.00920, 250=0.00700, 500=0.00560, 1000=0.00412, 5000=0.00296 (USD); Case/Package: 0402; Case Code (Metric): 1005; Case Code (Imperial): 0402; Min Operating Temperature: -55°C; Max Operating Temperature: 155°C; Packaging: Tape and Reel; Resistor Type: Thick Film; Number of Terminations: 2; Features: Moisture Resistant; Length: 0.039inch; Width: 0.02inch; Height: 0.016inch; RoHS Compliant: Yes; ComponentLink1URL: http://www.yageo.com/NewPortal/yageodocoutput?fileName=/pdf/R-Chip/PYu-RC_51_RoHS_P_0.pdf&src-supplier=Digi-Key; ComponentLink1Description: http://www.yageo.com/NewPortal/yageodocoutput?fileName=/pdf/R-Chip/PYu-RC_51_RoHS_P_0.pdf&src-supplier=Digi-Key; Supplier Part Number 1: YAG1279CT-ND
U6 U8 = 74LVC1G126GW-Q100H: Buffer/Line Driver Non-Inverting 5.5V 5-TSSOP 3-State Output Auto Qualified; Manufacturer: Nexperia; Supplier 1: Digi-Key; Manufacturer Part Number: 74LVC1G126GW-Q100H; RoHS: Yes; Category: Logic Gates; Stock 1: 19237; Pricing 1: 1=0.37000, 10=0.27800, 25=0.24320, 100=0.15750, 250=0.13040, 500=0.10430, 1000=0.07997 (USD); RoHS Compliant: Yes; Supplier Part Number 1: 1727-8420-1-ND
U7 U10 = 74LVC1G38GW,125: IC GATE NAND 1CH 2-INP 5-TSSOP; Manufacturer: Nexperia; Supplier 1: Mouser; Manufacturer Part Number: 74LVC1G38GW,125; RoHS: Yes; Category: Logic Gates; Stock 1: 14577; Pricing 1: 1=0.46000, 10=0.34700, 50=0.34700, 100=0.19700, 1000=0.10000, 10000=0.06900 (USD); RoHS Compliant: Yes; Supplier Part Number 1: 771-LVC1G38GW125
U9 = SN74LVC1G07DCKRE4: as U3 on sheet Power_Circuit; Supplier 1: Digi-Key; Manufacturer Part Number: SN74LVC1G07DCKRE4; RoHS: Yes; Category: Buffers, Drivers and Transceivers; Stock 1: 1390; Pricing 1: 1=0.32000, 10=0.24000, 25=0.21000, 100=0.13590, 250=0.11248, 500=0.09000, 1000=0.06900 (USD); Mount: Surface Mount; Case/Package: SC; Number of Pins: 5; Min Operating Temperature: -40°C; Max Operating Temperature: 125°C; Packaging: Tape and Reel; Package Quantity: 1; Number of Channels: 1; Number of Inputs: 1; Number of Outputs: 1; Number of Bits per Element: 1; Number of Input Lines: 1; Number of Output Lines: 1; Number of Gates: 1; Number of Bits: 1; Series: 74LVC; Technology: CMOS; Radiation Hardening: No; Reach SVHC Compliant: Yes; Lead Free: Lead Free; RoHS Compliant: Yes; ComponentLink1URL: https://datasheet.ciiva.com/14319/sn74lvc1g07-14319317.pdf?src-supplier=Avnet; ComponentLink1Description: https://datasheet.ciiva.com/14319/sn74lvc1g07-14319317.pdf?src-supplier=Avnet; ComponentLink2URL: https://datasheet.ciiva.com/18621/sn74lvc1g07-18621567.pdf?src-supplier=Digi-Key; ComponentLink2Description: https://datasheet.ciiva.com/18621/sn74lvc1g07-18621567.pdf?src-supplier=Digi-Key; Supplier Part Number 1: 296-35936-1-ND
U11 = SSM6N7002KFU,LF: Transistor MOSFET Array Dual N-CH 60V 300mA 6-Pin SOT-363 Emboss T/R; Manufacturer: Toshiba; FET Type: 2 N-Channel; Rds On Max: 1.5R; Input Capacitance: 40pF; Max Power Dissipation: 285mW; Supplier 1: Mouser; Manufacturer Part Number: SSM6N7002KFU,LF; RoHS: No; Category: MOSFETs; Stock 1: 840395; Pricing 1: 1=0.24000, 10=0.20400, 50=0.20400, 100=0.10800, 1000=0.04900, 10000=0.03200 (USD); Mount: Surface Mount; Packaging: Tape and Reel; Drain to Source Voltage (Vdss): 60V; Continuous Drain Current (ID): 300mA; ComponentLink1URL: http://www.mouser.com/ds/2/408/SSM6N7002KFU_datasheet_en_20170112-805921.pdf?src-supplier=Mouser; ComponentLink1Description: http://www.mouser.com/ds/2/408/SSM6N7002KFU_datasheet_en_20170112-805921.pdf?src-supplier=Mouser; ComponentLink2URL: http://toshiba.semicon-storage.com/info/docget.jsp?did=30374&prodName=SSM6N7002KFU&src-supplier=Digi-Key; ComponentLink2Description: http://toshiba.semicon-storage.com/info/docget.jsp?did=30374&prodName=SSM6N7002KFU&src-supplier=Digi-Key; Supplier Part Number 1: 757-SSM6N7002KFULF